# EAGLE design bt-shield-schmitt-totred (EAGLE 6.1)
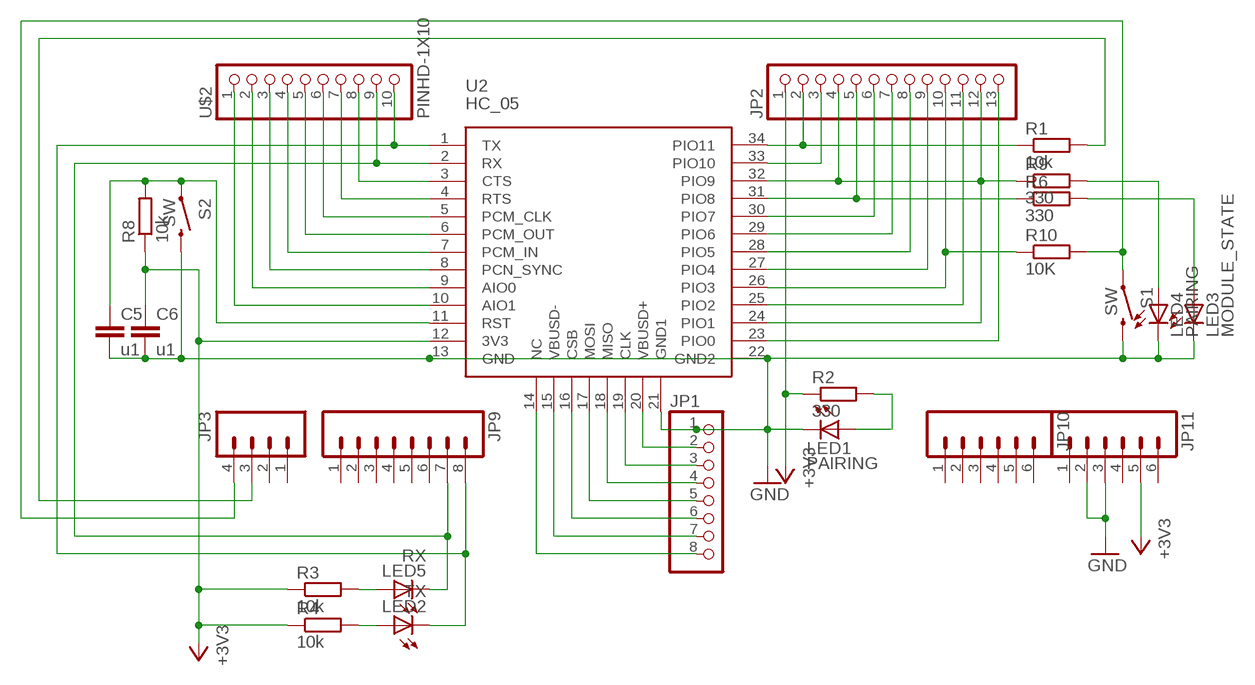
[diagram p0: schematic, sheet 1]

## Parts
C5  u1  C-EU025-025X050  [C025-025X050]
C6  u1  C-EU025-025X050  [C025-025X050]
JP1  PINHD-1X8BIG  [1X08-BIG]
JP2  PINHD-1X13_BIG  [1X13-BIG]
JP3  M04POLAR  [MOLEX-1X4]
JP9  M081X08  [1X08]
JP10  M06SIP  [1X06]
JP11  M06SIP  [1X06]
LED1  PAIRING  LED5MM  [LED5MM]
LED2  TX  LEDSQR2X5  [LED2X5]
LED3  MODULE_STATE  LED5MM  [LED5MM]
LED4  PAIRING  LED5MM  [LED5MM]
LED5  RX  LEDSQR2X5  [LED2X5]
R1  10k  R-EU_0207/2V  [0207/2V]
R2  330  R-EU_0204/5  [0204/5]
R3  10k  R-EU_0207/2V  [0207/2V]
R4  10k  R-EU_0207/2V  [0207/2V]
R6  330  R-EU_0204/5  [0204/5]
R8  10k  R-EU_0207/2V  [0207/2V]
R9  330  R-EU_0204/5  [0204/5]
R10  10K  R-EU_0204/7  [0204/7]
S1  SW  SWITCH-MOMENTARY-2PTH  [TACTILE-PTH]
S2  SW  SWITCH-MOMENTARY-2PTH  [TACTILE-PTH]
U2  HC_05  [BLUETOOTH_SMD]
U$2  PINHD-1X10  [1X10-BIG]

## Nets
+3V3: C6.1 JP2.1 JP11.5 R2.1 R3.1 R4.1 R8.1 U2.12(3V3)
GND: C5.2 C6.2 JP1.1 JP11.2 JP11.3 LED1.K(C) LED3.K(C) LED4.K(C) S1.3 S2.3 U2.13(GND) U2.21(GND1) U2.22(GND2)
N$1: JP3.4 R10.2 S1.1
N$2: JP3.3 R1.2
N$3: U2.3(CTS) U$2.8
N$4: C5.1 R8.2 S2.1 U2.11(RST)
N$5: JP2.3 U2.33(PIO10)
N$6: LED5.A R3.2
N$7: JP2.2 R1.1 U2.34(PIO11)
N$8: LED3.A R6.2
N$9: LED1.A R2.2
N$10: LED4.A R9.2
N$11: LED2.A R4.2
N$12: JP2.10 R10.1 U2.26(PIO3)
N$13: U2.4(RTS) U$2.7
N$15: U2.5(PCM_CLK) U$2.6
N$16: JP9.8 LED2.K(C) U2.1(TX) U$2.10
N$20: JP9.7 LED5.K(C) U2.2(RX) U$2.9
N$21: U2.6(PCM_OUT) U$2.5
N$22: U2.7(PCM_IN) U$2.4
N$23: U2.8(PCN_SYNC) U$2.3
N$24: U2.9(AIO0) U$2.2
N$25: U2.10(AIO1) U$2.1
N$26: JP2.4 JP2.12 R9.1 U2.24(PIO1) U2.32(PIO9)
N$27: JP2.5 R6.1 U2.31(PIO8)
N$28: JP2.6 U2.30(PIO7)
N$29: JP2.7 U2.29(PIO6)
N$30: JP2.8 U2.28(PIO5)
N$31: JP2.9 U2.27(PIO4)
N$32: JP2.11 U2.25(PIO2)
N$33: JP2.13 U2.23(PIO0)
N$34: JP1.2 U2.20(VBUSD+)
N$35: JP1.3 U2.19(CLK)
N$36: JP1.4 U2.18(MISO)
N$38: JP1.6 U2.16(CSB)
N$39: JP1.7 U2.15(VBUSD-)
N$40: JP1.8 U2.14(NC)
N$41: JP1.5 U2.17(MOSI)
Unconnected: JP3.1 JP3.2 JP9.1 JP9.2 JP9.3 JP9.4 JP9.5 JP9.6 JP10.1 JP10.2 JP10.3 JP10.4 JP10.5 JP10.6 JP11.1 JP11.4 JP11.6

## Library data of the parts
C5 C6 = rcl:C-EU: CAPACITOR, European symbol
JP1 = adafruit:PINHD-1X8: PIN HEADER
JP2 = adafruit:PINHD-1X13: PIN HEADER
JP3 = SparkFun:M04: Header 4 Standard 4-pin 0.1" header. Use with straight break away headers (SKU : PRT-00116), right angle break away headers (PRT-00553), swiss pins (PRT-00743), machine pins (PRT-00117), and female headers (PRT-00115). Molex polarized connector foot print use with SKU : PRT-08231 with associated crimp pins and housings. 1MM SMD Version SKU: PRT-10208
JP9 = SparkFun:M08: Header 8 Standard 8-pin 0.1" header. Use with straight break away headers (SKU : PRT-00116), right angle break away headers (PRT-00553), swiss pins (PRT-00743), machine pins (PRT-00117), and female headers (PRT-00115).
JP10 JP11 = SparkFun:M06: Header 6 Standard 6-pin 0.1" header. Use with straight break away headers (SKU : PRT-00116), right angle break away headers (PRT-00553), swiss pins (PRT-00743), machine pins (PRT-00117), and female headers (PRT-00115). Molex polarized connector foot print use with SKU : PRT-08094 with associated crimp pins and housings. NOTES ON THE VARIANTS LOCK and LOCK_LONGPADS... This footprint was designed to help hold the alignment of a through-hole component (i.e. 6-pin header) while soldering it into place. You may notice that each hole has been shifted either up or down by 0.005 of an inch from it's more standard position (which is a perfectly straight line). This slight alteration caused the pins (the squares in the middle) to touch the edges of the holes. Because they are alternating, it causes a "brace" to hold the component in place. 0.005 has proven to be the perfect amount of "off-center" position when using our standard breakaway headers. Although looks a little odd when you look at the bare footprint, once you have a header in there, the alteration is very hard to notice. Also, if you push a header all the way into place, it is covered up entirely on the bottom side. This idea of altering the position of holes to aid alignment will be further integrated into the Sparkfun Library for other footprints. It can help hold any component with 3 or more connection pins.
LED1-LED5 = led:LED: LED OSRAM: - CHIPLED LG R971, LG N971, LY N971, LG Q971, LY Q971, LO R971, LY R971 LH N974, LH R974 LS Q976, LO Q976, LY Q976 LO Q996 - Hyper CHIPLED LW Q18S LB Q993, LB Q99A, LB R99A - SideLED LS A670, LO A670, LY A670, LG A670, LP A670 LB A673, LV A673, LT A673, LW A673 LH A674 LY A675 LS A676, LA A676, LO A676, LY A676, LW A676 LS A679, LY A679, LG A679 - Hyper Micro SIDELED® LS Y876, LA Y876, LO Y876, LY Y876 LT Y87S - SmartLED LW L88C, LW L88S LB L89C, LB L89S, LG L890 LS L89K, LO L89K, LY L89K LS L896, LA L896, LO L896, LY L896 - TOPLED LS T670, LO T670, LY T670, LG T670, LP T670 LSG T670, LSP T670, LSY T670, LOP T670, LYG T670 LG T671, LOG T671, LSG T671 LB T673, LV T673, LT T673, LW T673 LH T674 LS T676, LA T676, LO T676, LY T676, LB T676, LH T676, LSB T676, LW T676 LB T67C, LV T67C, LT T67C, LS T67K, LO T67K, LY T67K, LW E67C LS E67B, LA E67B, LO E67B, LY E67B, LB E67C, LV E67C, LT E67C LW T67C LS T679, LY T679, LG T679 LS T770, LO T770, LY T770, LG T770, LP T770 LB T773, LV T773, LT T773, LW T773 LH T774 LS E675, LA E675, LY E675, LS T675 LS T776, LA T776, LO T776, LY T776, LB T776 LHGB T686 LT T68C, LB T68C - Hyper Mini TOPLED® LB M676 - Mini TOPLED Santana® LG M470 LS M47K, LO M47K, LY M47K Source: http://www.osram.convergy.de LUXEON: - LUMILED® LXK2-PW12-R00, LXK2-PW12-S00, LXK2-PW14-U00, LXK2-PW14-V00 LXK2-PM12-R00, LXK2-PM12-S00, LXK2-PM14-U00 LXK2-PE12-Q00, LXK2-PE12-R00, LXK2-PE12-S00, LXK2-PE14-T00, LXK2-PE14-U00 LXK2-PB12-K00, LXK2-PB12-L00, LXK2-PB12-M00, LXK2-PB14-N00, LXK2-PB14-P00, LXK2-PB14-Q00 LXK2-PR12-L00, LXK2-PR12-M00, LXK2-PR14-Q00, LXK2-PR14-R00 LXK2-PD12-Q00, LXK2-PD12-R00, LXK2-PD12-S00 LXK2-PH12-R00, LXK2-PH12-S00 LXK2-PL12-P00, LXK2-PL12-Q00, LXK2-PL12-R00 Source: www.luxeon.com KINGBRIGHT: KA-3528ASYC Source: www.kingbright.com
R1-R4 R6 R8-R10 = rcl:R-EU_: RESISTOR, European symbol
S1 S2 = SparkFun:SWITCH-MOMENTARY-2
U2 = SerialPortBluetooth:HC_05
U$2 = adafruit:PINHD-1X10: Pin header 1x10 0.1" spacing With round pins

## Board
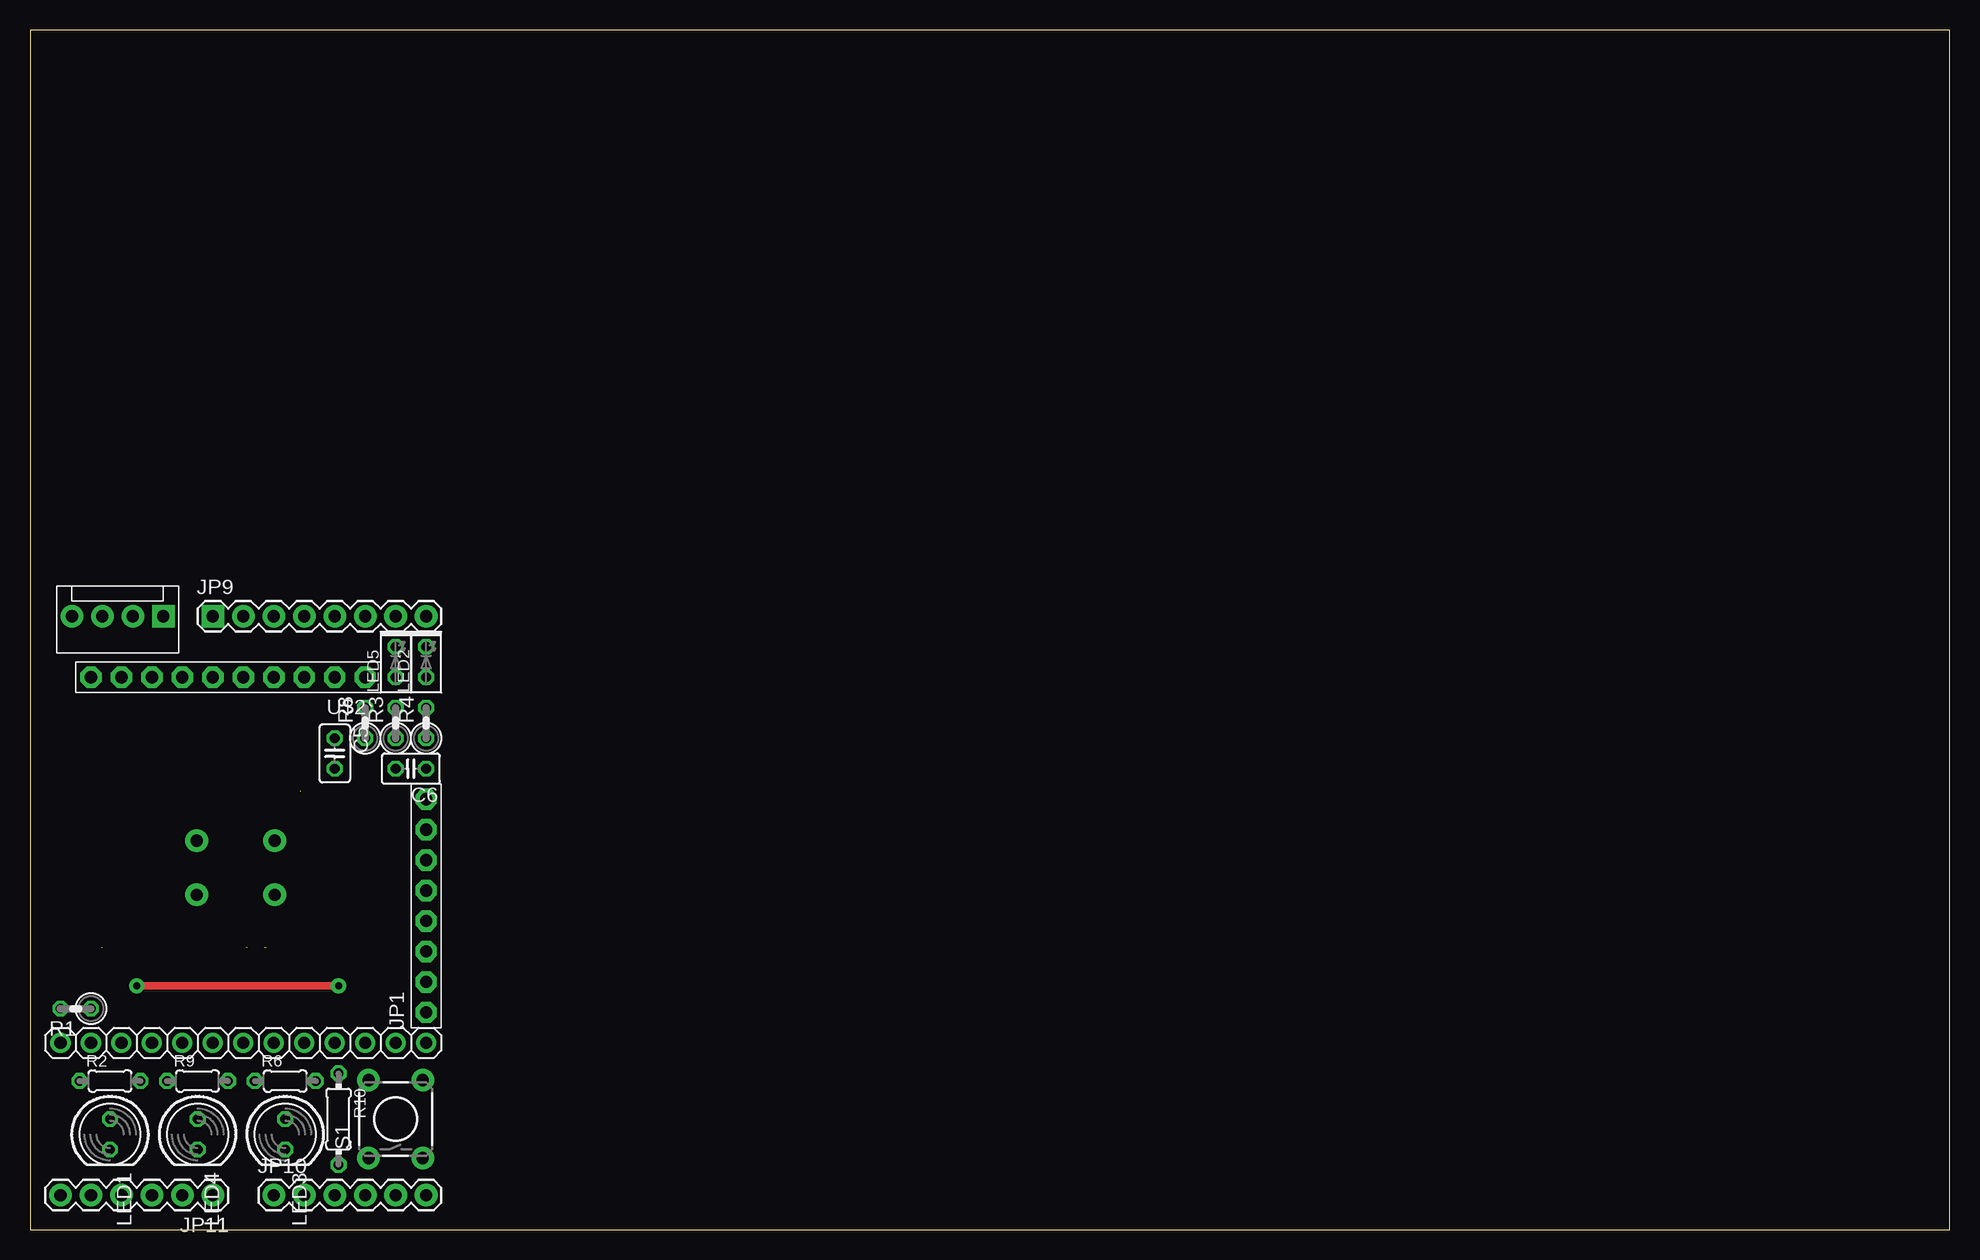
[diagram p1: board, top side]
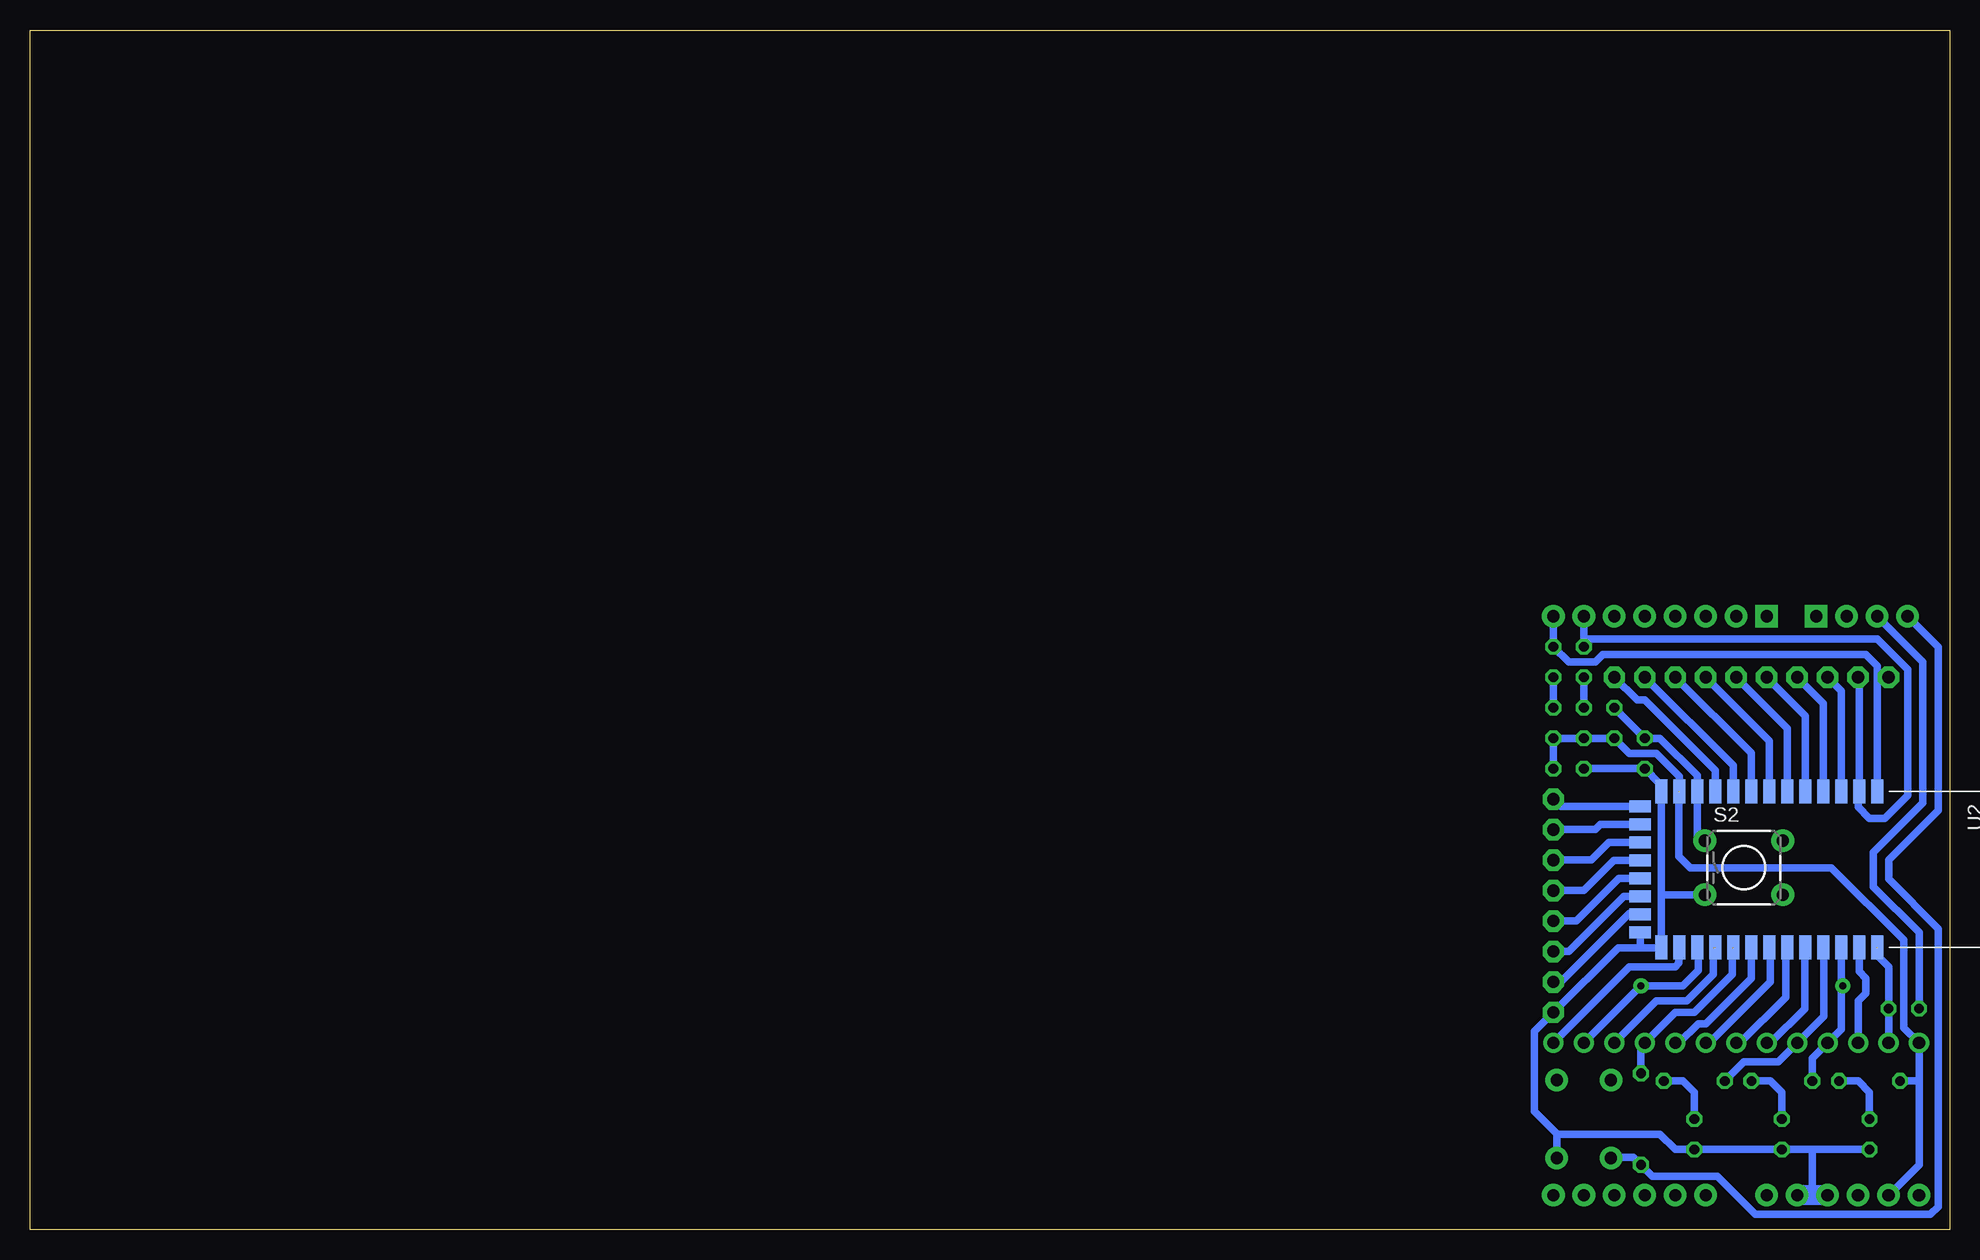
[diagram p2: board, bottom side, seen from below]

Size 160 x 100 mm. Coordinates in mm from the lower left corner, seen from the top.
Outline: 0,0 160,0 160,100 0,100 0,0
Copper layers (1*16): Top 0.035mm / dielectric 1.5mm / Bottom 0.035mm
Design rules: minimum track width 10mil, minimum drill 24mil, track to track 8mil, track to pad 8mil, pad to pad 8mil, via to via 8mil, smd to smd 8mil, copper to edge 40mil, drill to drill 8mil, minimum pad ring 10mil, minimum via ring 8mil, stop-mask expansion 4mil, vias tented up to drill 0mil, thermal gap 10mil

### Footprints (pad centres in the part's own frame; a part is rotated, then mirrored left to right if it is on the bottom)
C025-025X050 = drill 0.813 octagon: 1 -1.27,0; 2 1.27,0
1X08-BIG = drill 1.016 pad 1.778 octagon: 1 -8.89,0; 2 -6.35,0; 3 -3.81,0; 4 -1.27,0; 5 1.27,0; 6 3.81,0; 7 6.35,0; 8 8.89,0
1X13-BIG = drill 1.016 pad 1.676: 1 -15.24,0; 2 -12.7,0; 3 -10.16,0; 4 -7.62,0; 5 -5.08,0; 6 -2.54,0; 7 0,0; 8 2.54,0; 9 5.08,0; 10 7.62,0; 11 10.16,0; 12 12.7,0; 13 15.24,0
MOLEX-1X4 = drill 1.016 pad 1.88 square: 1 0,0 | drill 1.016 pad 1.88: 2 2.54,0; 3 5.08,0; 4 7.62,0
1X08 = drill 1.016 pad 1.88 square: 1 0,0 | drill 1.016 pad 1.88: 2 2.54,0; 3 5.08,0; 4 7.62,0; 5 10.16,0; 6 12.7,0; 7 15.24,0; 8 17.78,0
1X06 = drill 1.016 pad 1.88: 1 0,0; 2 2.54,0; 3 5.08,0; 4 7.62,0; 5 10.16,0; 6 12.7,0
LED5MM = drill 0.813 octagon: A -1.27,0; K 1.27,0
LED2X5 = drill 0.813 octagon: A -1.27,0; K 1.27,0
0207/2V = drill 0.813 octagon: 1 -1.27,0; 2 1.27,0
0204/5 = drill 0.813 octagon: 1 -2.54,0; 2 2.54,0
0204/7 = drill 0.813 octagon: 1 -3.81,0; 2 3.81,0
TACTILE-PTH = drill 1.016 pad 1.88: 1 -3.251,2.261; 2 3.251,2.261; 3 -3.251,-2.261; 4 3.251,-2.261
BLUETOOTH_SMD = smd 2 x 1: 1 0,0; 2 0,-1.5; 3 0,-3; 4 0,-4.5; 5 0,-6; 6 0,-7.5; 7 0,-9; 8 0,-10.5; 9 0,-12; 10 0,-13.5; 11 0,-15; 12 0,-16.5; 13 0,-18; 22 13,-18; 23 13,-16.5; 24 13,-15; 25 13,-13.5; 26 13,-12; 27 13,-10.5; 28 13,-9; 29 13,-7.5; 30 13,-6; 31 13,-4.5; 32 13,-3; 33 13,-1.5; 34 13,0 | smd 1 x 1.8: 14 1.25,-19.75; 15 2.75,-19.75; 16 4.25,-19.75; 17 5.75,-19.75; 18 7.25,-19.75; 19 8.75,-19.75; 20 10.25,-19.75; 21 11.75,-19.75
1X10-BIG = drill 1.016 pad 1.778 octagon: 1 -11.43,0; 2 -8.89,0; 3 -6.35,0; 4 -3.81,0; 5 -1.27,0; 6 1.27,0; 7 3.81,0; 8 6.35,0; 9 8.89,0; 10 11.43,0

### Placement (x,y rotation side)
C5  25.4,39.69 270 top
C6  31.75,38.42 180 top
JP1  33.02,26.99 90 top
JP2  17.78,15.56 0 top
JP3  11.11,51.12 180 top
JP9  15.24,51.12 0 top
JP10  20.32,2.86 0 top
JP11  15.24,2.86 180 top
LED1  6.67,7.94 270 top
LED2  33.02,47.31 90 top
LED3  21.27,7.94 270 top
LED4  13.97,7.94 270 top
LED5  30.48,47.31 90 top
R1  3.81,18.41 180 top
R2  6.67,12.38 0 top
R3  30.48,42.23 90 top
R4  33.02,42.23 90 top
R6  21.27,12.38 0 top
R8  27.94,42.23 90 top
R9  13.97,12.38 0 top
R10  25.72,9.21 270 top
S1  30.48,9.21 90 top
S2  17.14,30.16 0 bottom
U2  6.03,36.51 270 bottom
U$2  16.51,46.04 180 top

### Tracks (layer width: path | path; a pad name or v marks a point on that pad's centre or on a via)
+3V3  (1 unrouted)
  Bottom 0.61: 22.54,36.5 U2.12 22.53,37.77 24.45,39.69 26.67,39.69 R8.1 R3.1 R4.1 C6.1 | 2.54,12.38 JP2.1 3.81,16.83 3.81,24.13 9.84,30.16 21.59,30.16 22.54,31.11 22.54,36.51 | 2.54,12.38 2.54,5.4 JP11.5 | R2.1 2.54,12.38
GND
  Bottom 0.61: 25.72,23.5 24.05,23.5 U2.22 24.03,27.9 | 25.72,23.5 25.78,23.56 U2.21 | 25.72,23.5 27.62,23.5 JP1.1 34.61,16.51 34.61,9.84 32.7,7.94 | U2.13 24.03,27.9 | U2.13 24.13,36.51 | U2.13 24.13,36.61 24.13,37.15 C5.2 C6.2 | S1.3 32.74,7.9 32.7,7.94 | 9.84,3.17 JP11.3 | 32.7,7.94 24.13,7.94 22.86,6.67 LED3.K LED4.K 11.43,6.67 | 11.43,6.67 LED1.K | JP11.2 11.75,2.86 11.43,3.17 11.43,6.67 | 24.03,27.9 S2.3
  Bottom 1.676: JP11.3 JP11.2
N$1
  Bottom 0.61: S1.1 28.22,5.99 28.26,6.03 26.35,6.03 R10.2 24.77,4.45 19.37,4.45 16.19,1.27 1.59,1.27 0.95,1.91 0.95,25.08 5.08,29.21 5.08,30.8 0.95,34.92 0.95,48.58 JP3.4
N$2
  Bottom 0.61: R1.2 2.54,24.77 6.35,28.57 6.35,31.43 2.22,35.56 2.22,47.31 JP3.3
N$3
  Bottom 0.61: U2.3 9.03,44.91 U$2.8
N$4
  Bottom 0.61: S2.1 20.68,32.38 20.64,32.38 21.03,32.78 U2.11 21.03,37.86 24.13,40.96 C5.1 R8.2
N$5
  Bottom 0.61: U2.33 7.53,21.5 6.99,20.95 6.99,19.68 7.62,19.05 JP2.3
N$6
  Bottom 0.61: R3.2 LED5.A
N$7  (1 unrouted)
  Bottom 0.61: JP2.2 R1.1 5.08,21.91 6.03,22.86 6.03,23.5
N$8
  Bottom 0.61: R6.2 22.23,12.38 21.27,11.43 LED3.A
N$9
  Bottom 0.61: R2.2 7.62,12.38 6.67,11.43 LED1.A
N$10
  Bottom 0.61: R9.2 14.92,12.38 13.97,11.43 LED4.A
N$11
  Bottom 0.61: R4.2 LED2.A
N$12  (1 unrouted)
  Bottom 0.61: 18.1,23.5 18.1,21.27 21.27,18.1 22.86,18.1 JP2.10 25.72,15.24 R10.1
N$13
  Bottom 0.61: U2.4 10.53,43.87 U$2.7
N$15
  Bottom 0.61: U2.5 12.03,42.83 U$2.6
N$16
  Bottom 0.61: U2.1 6.03,46.04 | 6.03,46.04 6.03,46.99 6.99,47.94 28.89,47.94 29.53,47.31 31.75,47.31 LED2.K JP9.8 | U$2.10 6.03,46.04
N$20
  Bottom 0.61: 7.62,36.6 U2.2 | U2.2 7.53,45.95 U$2.9 | U2.2 7.62,36.42 7.62,35.24 6.67,34.29 5.4,34.29 3.49,36.2 3.49,46.67 6.03,49.21 30.48,49.21 | 30.48,49.21 JP9.7 | 30.48,49.21 LED5.K
N$21
  Bottom 0.61: U2.6 13.53,41.79 U$2.5
N$22
  Bottom 0.61: U2.7 15.03,40.75 U$2.4
N$23
  Bottom 0.61: U2.8 16.53,39.71 U$2.3
N$24
  Bottom 0.61: U2.9 18.03,38.67 U$2.2
N$25
  Bottom 0.61: U2.10 19.53,38.27 25.4,44.13 26.04,44.13 U$2.1
N$26  (via drill 0.6 pad 1.27)
  Top 0.61: v8.89,20.32 v25.72,20.32
  Bottom 0.61: U2.24 20.95,23.43 20.95,21.59 22.23,20.32 v25.72,20.32 JP2.12 | R9.1 11.43,14.29 JP2.4 9.03,16.68 U2.32 9.03,20.64 v8.89,20.32
N$27
  Bottom 0.61: U2.31 10.48,23.46 10.48,17.78 JP2.5 14.29,13.97 17.14,13.97 R6.1
N$28
  Bottom 0.61: JP2.6 14.92,15.56 12.06,18.41 12.06,23.48 U2.30
N$29
  Bottom 0.61: JP2.7 17.46,15.56 13.65,19.37 13.65,23.39 U2.29
N$30
  Bottom 0.61: JP2.8 20,15.56 14.92,20.64 14.92,23.4 U2.28
N$31
  Bottom 0.61: JP2.9 22.54,15.56 20.95,17.14 20.32,17.14 16.53,20.93 U2.27 16.51,23.49
N$32  (1 unrouted)
  Bottom 0.61: JP2.11 24.45,19.05 21.91,19.05 19.68,21.27 19.68,23.5
N$33
  Bottom 0.61: U2.23 22.54,23.5 22.54,22.23 22.86,21.91 26.67,21.91 JP2.13
N$34
  Bottom 0.61: U2.20 25.87,26.35 26.67,26.35 32.38,20.64 JP1.2
N$35
  Bottom 0.61: JP1.3 31.75,23.18 27.16,27.76 U2.19
N$36
  Bottom 0.61: JP1.4 31.11,25.72 27.57,29.26 U2.18
N$38
  Bottom 0.61: JP1.6 29.84,30.8 28.38,32.26 U2.16
N$39
  Bottom 0.61: JP1.7 29.53,33.34 29.1,33.76 U2.15
N$40
  Bottom 0.61: JP1.8 32.41,35.26 U2.14
N$41
  Bottom 0.61: JP1.5 30.48,28.26 27.98,30.76 U2.17